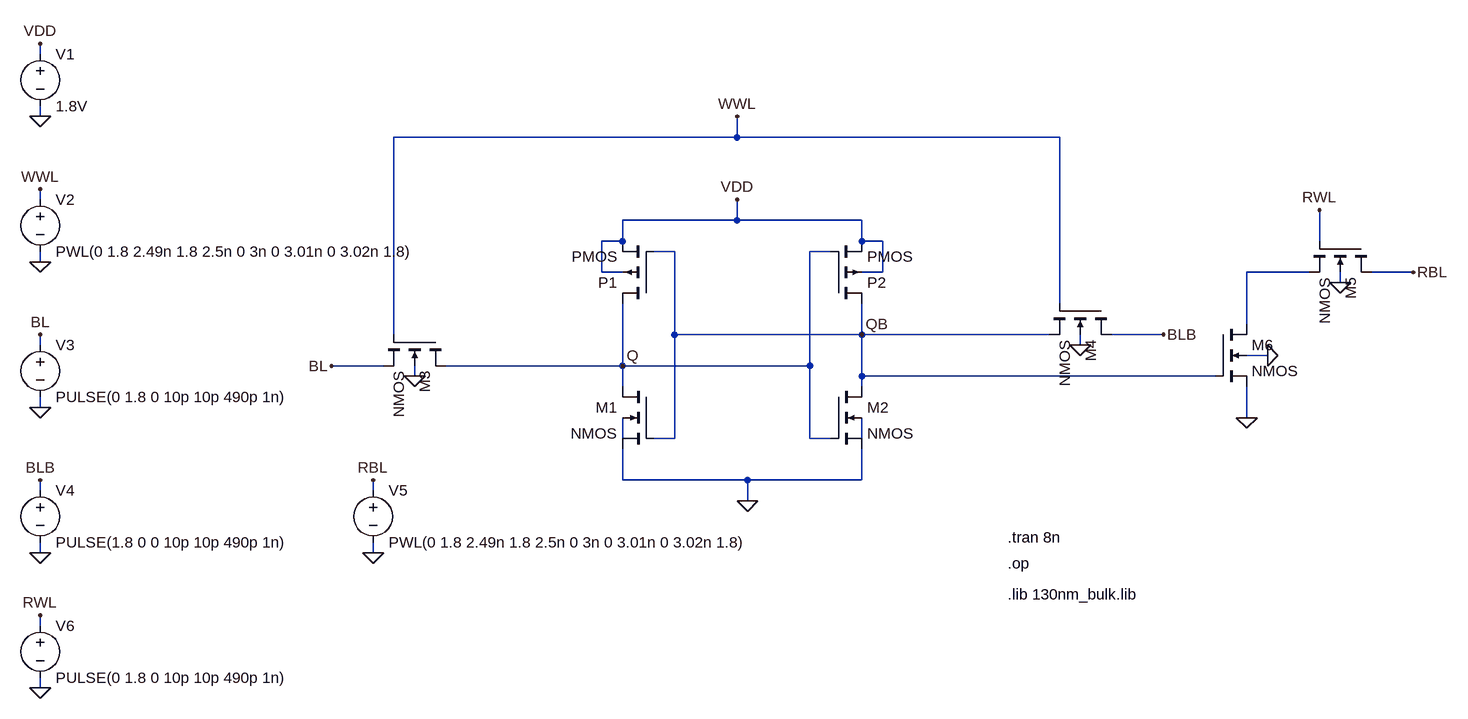
[diagram p0: schematic 8T.asc]
8T.asc, the LTspice schematic file:
Version 4
SHEET 1 1264 680
WIRE -912 -1024 -912 -1040
WIRE -912 -928 -912 -944
WIRE 160 -896 160 -928
WIRE 160 -896 -368 -896
WIRE 656 -896 160 -896
WIRE -912 -800 -912 -816
WIRE 160 -768 160 -800
WIRE 160 -768 -16 -768
WIRE 352 -768 160 -768
WIRE -16 -736 -16 -768
WIRE -16 -736 -48 -736
WIRE 352 -736 352 -768
WIRE 384 -736 352 -736
WIRE 1056 -736 1056 -784
WIRE 64 -720 32 -720
WIRE 304 -720 272 -720
WIRE -912 -704 -912 -720
WIRE -48 -688 -48 -736
WIRE -16 -688 -48 -688
WIRE 384 -688 384 -736
WIRE 384 -688 352 -688
WIRE 1040 -688 944 -688
WIRE 1200 -688 1136 -688
WIRE 1088 -672 1088 -688
WIRE 656 -640 656 -896
WIRE 944 -608 944 -688
WIRE -368 -592 -368 -896
WIRE 64 -592 64 -720
WIRE 352 -592 352 -640
WIRE 352 -592 64 -592
WIRE 640 -592 352 -592
WIRE 816 -592 736 -592
WIRE -912 -576 -912 -592
WIRE 688 -576 688 -592
WIRE 976 -560 944 -560
WIRE -384 -544 -464 -544
WIRE -16 -544 -16 -640
WIRE -16 -544 -288 -544
WIRE 272 -544 272 -720
WIRE 272 -544 -16 -544
WIRE -336 -528 -336 -544
WIRE 352 -528 352 -592
WIRE 896 -528 352 -528
WIRE -16 -512 -16 -544
WIRE 352 -512 352 -528
WIRE -912 -480 -912 -496
WIRE 944 -464 944 -512
WIRE -16 -432 -16 -464
WIRE 64 -432 64 -592
WIRE 64 -432 32 -432
WIRE 272 -432 272 -544
WIRE 304 -432 272 -432
WIRE 352 -432 352 -464
WIRE -16 -368 -16 -416
WIRE 176 -368 -16 -368
WIRE 352 -368 352 -416
WIRE 352 -368 176 -368
WIRE -912 -352 -912 -368
WIRE -400 -352 -400 -368
WIRE 176 -336 176 -368
WIRE -912 -256 -912 -272
WIRE -400 -256 -400 -272
WIRE -912 -144 -912 -160
WIRE -912 -48 -912 -64
FLAG 160 -800 VDD
FLAG 944 -464 0
FLAG 176 -336 0
FLAG -464 -544 BL
FLAG 816 -592 BLB
FLAG 160 -928 WWL
FLAG 1200 -688 RBL
FLAG 1056 -784 RWL
FLAG -912 -1040 VDD
FLAG -912 -816 WWL
FLAG -912 -592 BL
FLAG -912 -368 BLB
FLAG -400 -368 RBL
FLAG -912 -160 RWL
FLAG -912 -928 0
FLAG -912 -704 0
FLAG -912 -480 0
FLAG -912 -256 0
FLAG -912 -48 0
FLAG -400 -256 0
FLAG -16 -544 Q
FLAG 352 -592 QB
FLAG -336 -528 0
FLAG 688 -576 0
FLAG 976 -560 0
FLAG 1088 -672 0
SYMBOL nmos4 304 -512 R0
SYMATTR InstName M2
SYMATTR Value2 l=130n w=0.4u
SYMBOL nmos4 32 -512 M0
SYMATTR InstName M1
SYMATTR Value2 l=130n w=0.4u
SYMBOL pmos4 32 -640 R180
SYMATTR InstName P1
SYMATTR Value2 l=130n w=0.4u
SYMBOL pmos4 304 -640 M180
SYMATTR InstName P2
SYMATTR Value2 l=130n w=0.4u
SYMBOL nmos4 -288 -592 R90
SYMATTR InstName M3
SYMATTR Value2 l=130n w=0.4u
SYMBOL nmos4 736 -640 R90
SYMATTR InstName M4
SYMATTR Value2 l=130n w=0.4u
SYMBOL nmos4 896 -608 R0
SYMATTR InstName M6
SYMATTR Value2 l=130n w=0.4u
SYMBOL nmos4 1136 -736 R90
SYMATTR InstName M5
SYMBOL voltage -912 -1040 R0
SYMATTR InstName V1
SYMATTR Value 1.8V
SYMBOL voltage -912 -816 R0
WINDOW 123 0 0 Left 0
WINDOW 39 0 0 Left 0
SYMATTR InstName V2
SYMATTR Value PWL(0 1.8 2.49n 1.8 2.5n 0 3n 0 3.01n 0 3.02n 1.8)
SYMBOL voltage -912 -592 R0
WINDOW 123 0 0 Left 0
WINDOW 39 0 0 Left 0
SYMATTR InstName V3
SYMATTR Value PULSE(0 1.8 0 10p 10p 490p 1n)
SYMBOL voltage -912 -368 R0
WINDOW 123 0 0 Left 0
WINDOW 39 0 0 Left 0
SYMATTR InstName V4
SYMATTR Value PULSE(1.8 0 0 10p 10p 490p 1n)
SYMBOL voltage -400 -368 R0
WINDOW 123 0 0 Left 0
WINDOW 39 0 0 Left 0
SYMATTR InstName V5
SYMATTR Value PWL(0 1.8 2.49n 1.8 2.5n 0 3n 0 3.01n 0 3.02n 1.8)
SYMBOL voltage -912 -160 R0
WINDOW 123 0 0 Left 0
WINDOW 39 0 0 Left 0
SYMATTR InstName V6
SYMATTR Value PULSE(0 1.8 0 10p 10p 490p 1n)
TEXT 576 -280 Left 2 !.tran 8n
TEXT 576 -240 Left 2 !.op
TEXT 576 -192 Left 2 !.lib 130nm_bulk.lib

The netlist it stands for:
* 8T.asc
M2 QB Q 0 N003 NMOS l=130n w=0.4u
M1 Q QB 0 N002 NMOS l=130n w=0.4u
M§P1 Q QB VDD VDD PMOS l=130n w=0.4u
M§P2 QB Q VDD VDD PMOS l=130n w=0.4u
M3 Q WWL BL 0 NMOS l=130n w=0.4u
M4 BLB WWL QB 0 NMOS l=130n w=0.4u
M6 N001 QB 0 0 NMOS l=130n w=0.4u
M5 RBL RWL N001 0 NMOS
V1 VDD 0 1.8V
V2 WWL 0 PWL(0 1.8 2.49n 1.8 2.5n 0 3n 0 3.01n 0 3.02n 1.8)
V3 BL 0 PULSE(0 1.8 0 10p 10p 490p 1n)
V4 BLB 0 PULSE(1.8 0 0 10p 10p 490p 1n)
V5 RBL 0 PWL(0 1.8 2.49n 1.8 2.5n 0 3n 0 3.01n 0 3.02n 1.8)
V6 RWL 0 PULSE(0 1.8 0 10p 10p 490p 1n)
.model NMOS NMOS
.model PMOS PMOS
.lib standard.mos
.tran 8n
.op
.lib 130nm_bulk.lib
.backanno
.end